# EAGLE schematic zdrojV20 (EAGLE 9.5.1)
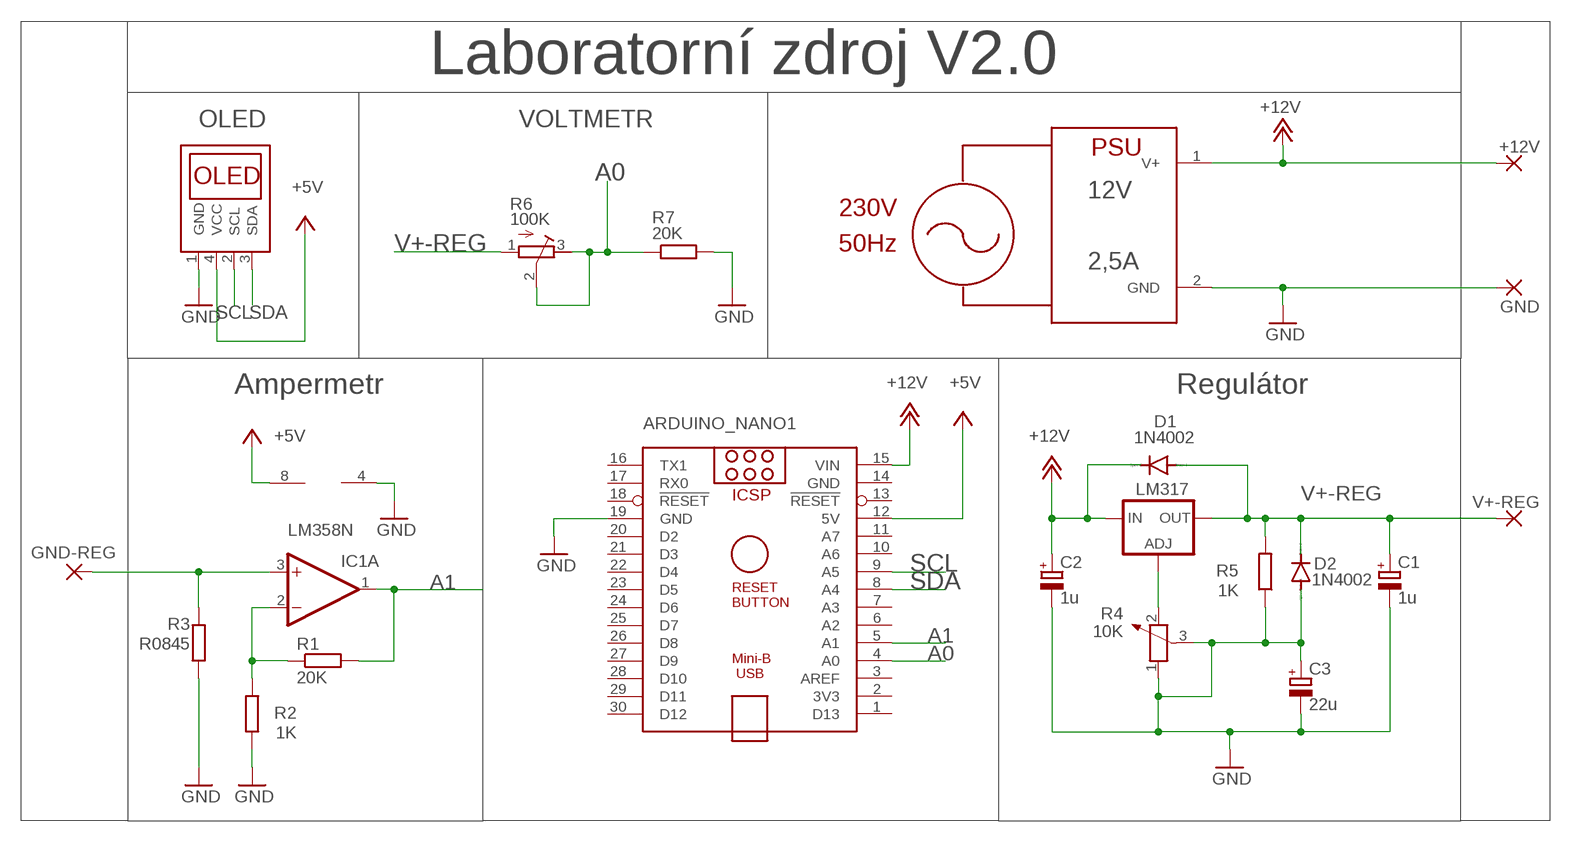
[diagram p0: schematic, sheet 1]

## Parts
+12V  3,81/1,4  [3,81/1,4]
ARDUINO_NANO1  ARDUINO_NANO  [ARDUINO_NANO]
C1  1u  CPOL-EUE2,5-6E  [E2,5-6E]
C2  1u  CPOL-EUE2,5-6E  [E2,5-6E]
C3  22u  CPOL-EUE2,5-6E  [E2,5-6E]
D1  1N4002  1N4004  [DO41-10]
D2  1N4002  1N4004  [DO41-10]
GND  3,81/1,4  [3,81/1,4]
GND-REG  3,81/1,4  [3,81/1,4]
IC1  LM358N  [DIL08]
IC2  LM317  LM317TS  [317TS]
R1  20K  R-EU_0204/7  [0204/7]
R2  1K  R-EU_0204/7  [0204/7]
R3  R0845  R-EU_0414/5V  [0414V]
R4  10K  POTENTIOMETER_PT-10S  [PT-10S]
R5  1K  R-EU_0207/10  [0207/10]
R6  100K  R-TRIMM3339P  [RTRIM3339P]
R7  20K  R-EU_0204/7  [0204/7]
U$1  OLEDTWII2C  [1X04]
U$2  PSU  [1X02]
V+-REG  3,81/1,4  [3,81/1,4]

## Nets
+5V: ARDUINO_NANO1.12(5V) IC1.8(P:V+) U$1.4(VCC)
+12V: +12V.1(P) ARDUINO_NANO1.15(VIN) C2.+ D1.C IC2.3(IN) U$2.1(V+)
A0: ARDUINO_NANO1.4(A0) R6.2(S) R6.3(E) R7.1
A1: ARDUINO_NANO1.5(A1) IC1.1(A:OUT) R1.2
GND: ARDUINO_NANO1.19(GND) C1.- C2.- C3.+ C3.- D2.A GND.1(P) IC1.4(P:V-) R2.1 R3.1 R4.1 R4.3 R5.1 R7.2 U$1.1(GND) U$2.2(GND)
N$1: IC1.2(A:-IN) R1.1 R2.2
N$3: GND-REG.1(P) IC1.3(A:+IN) R3.2
N$4: IC2.1(ADJ) R4.2
SCL: ARDUINO_NANO1.9(A5) U$1.2(SCL)
SDA: ARDUINO_NANO1.8(A4) U$1.3(SDA)
V+-REG: C1.+ D1.A D2.C IC2.2(OUT) R5.2 R6.1(A) V+-REG.1(P)
Unconnected: ARDUINO_NANO1.1(D13) ARDUINO_NANO1.2(3V3) ARDUINO_NANO1.3(AREF) ARDUINO_NANO1.6(A2) ARDUINO_NANO1.7(A3) ARDUINO_NANO1.10(A6) ARDUINO_NANO1.11(A7) ARDUINO_NANO1.13(!RESET) ARDUINO_NANO1.16(TX1) ARDUINO_NANO1.17(RX0) ARDUINO_NANO1.18(!RESET) ARDUINO_NANO1.20(D2) ARDUINO_NANO1.21(D3) ARDUINO_NANO1.22(D4) ARDUINO_NANO1.23(D5) ARDUINO_NANO1.24(D6) ARDUINO_NANO1.25(D7) ARDUINO_NANO1.26(D8) ARDUINO_NANO1.27(D9) ARDUINO_NANO1.28(D10) ARDUINO_NANO1.29(D11) ARDUINO_NANO1.30(D12) IC1.5(B:+IN) IC1.6(B:-IN) IC1.7(B:OUT)

## Notes on the sheet
- Laboratorní zdroj V2.0
- OLED | VOLTMETR
- 12V
- 2,5A
- Ampermetr | Regulátor

## Power pins joined to a net without a drawn wire
GND: ARDUINO_NANO1.14(GND)

## Library data of the parts
+12V GND GND-REG V+-REG = wirepad:3,81/1,4: THROUGH-HOLE PAD
ARDUINO_NANO1 = ArduinoNanoV30:ARDUINO_NANO: Arduino Nano V3.0 Overview: The Arduino Nano is a small, complete, and breadboard-friendly board based on the ATmega328 (Arduino Nano 3.x) or ATmega168 (Arduino Nano 2.x). It has more or less the same functionality of the Arduino Duemilanove, but in a different package. It lacks only a DC power jack, and works with a Mini-B USB cable instead of a standard one. The Nano was designed and is being produced by Gravitech. Specifications: Microcontroller Atmel ATmega168 or ATmega328 Operating Voltage (logic level) 5 V Input Voltage (recommended) 7-12 V Input Voltage (limits) 6-20 V Digital I/O Pins 14 (of which 6 provide PWM output) Analog Input Pins 8 DC Current per I/O Pin 40 mA Flash Memory 16 KB (ATmega168) or 32 KB (ATmega328) of which 2 KB used by bootloader SRAM 1 KB (ATmega168) or 2 KB (ATmega328) EEPROM 512 bytes (ATmega168) or 1 KB (ATmega328) Clock Speed 16 MHz Dimensions 0.73" x 1.70" Length 45 mm Width 18 mm Weigth 5 g Power: The Arduino Nano can be powered via the Mini-B USB connection, 6-20V unregulated external power supply (pin 30), or 5V regulated external power supply (pin 27). The power source is automatically selected to the highest voltage source. Memory: The ATmega168 has 16 KB of flash memory for storing code (of which 2 KB is used for the bootloader); the ATmega328 has 32 KB, (also with 2 KB used for the bootloader). The ATmega168 has 1 KB of SRAM and 512 bytes of EEPROM (which can be read and written with the EEPROM library); the ATmega328 has 2 KB of SRAM and 1 KB of EEPROM. Input and Output: Each of the 14 digital pins on the Nano can be used as an input or output, using pinMode(), digitalWrite(), and digitalRead() functions. They operate at 5 volts. Each pin can provide or receive a maximum of 40 mA and has an internal pull-up resistor (disconnected by default) of 20-50 kOhms. In addition, some pins have specialized functions. Visit Arduino - ArduinoBoardNano <https://www.arduino.cc/en/Main/ArduinoBoardNano>
C1-C3 = rcl:CPOL-EU: POLARIZED CAPACITOR, European symbol; SPICEPREFIX: C
D1 D2 = diode:1N4004: DIODE general purpose rectifier, 1 A
IC1 = linear:LM358: OP AMP also LM158; LM258; LM2904 Source: http://cache.national.com/ds/LM/LM158.pdf
IC2 = v-reg:LM317TS: VOLTAGE REGULATOR
R1-R3 R5 R7 = rcl:R-EU_: RESISTOR, European symbol; SPICEPREFIX: R
R4 = rcl:POTENTIOMETER_: Potentiometer; SPICEMODEL: POT; SPICEPREFIX: X
R6 = rcl:R-TRIMM: Trimm resistor; SPICEMODEL: X; SPICEPREFIXL: POT
U$1 = schematic:OLEDTWI
U$2 = schematic:PSU